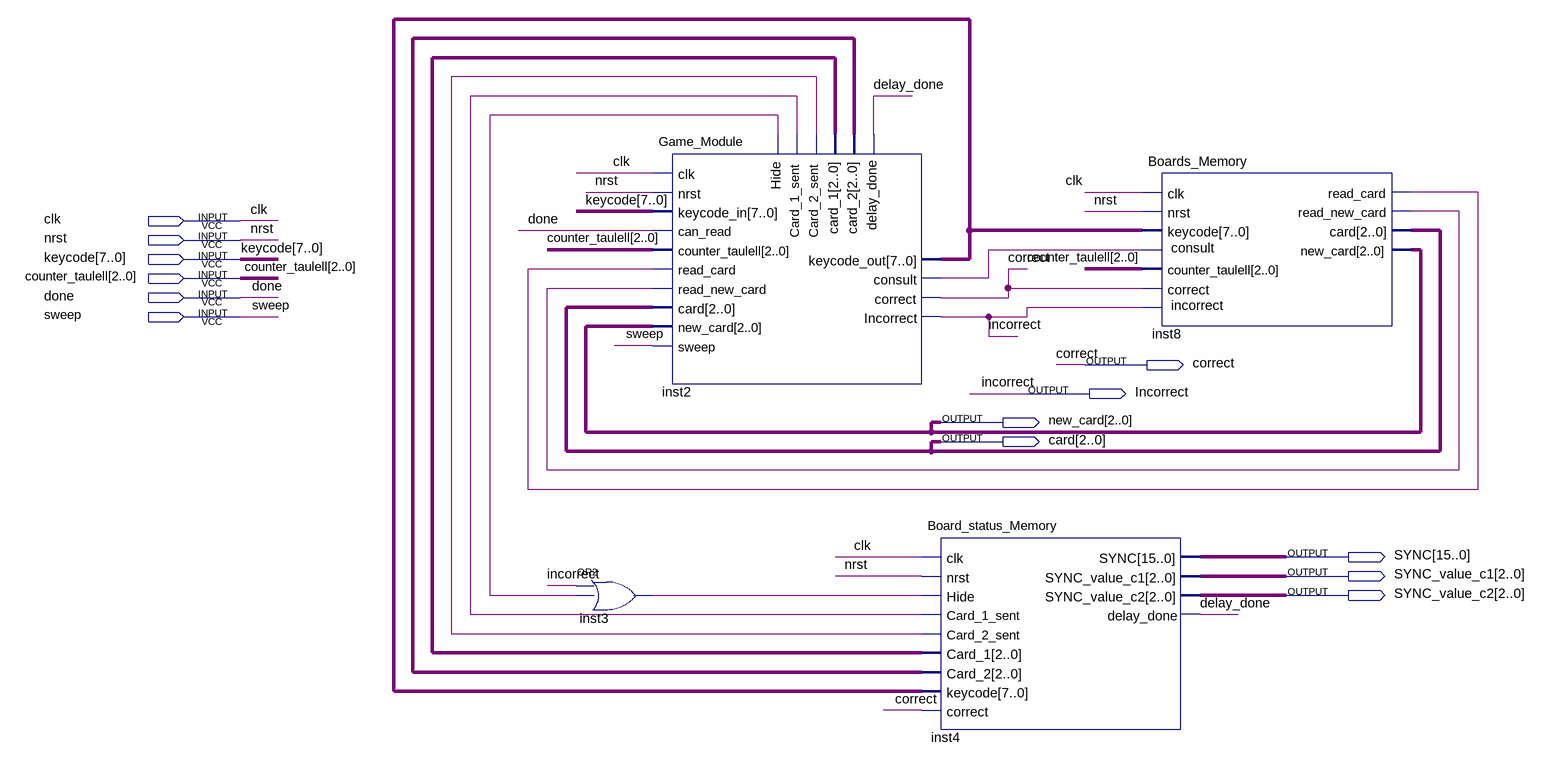
[diagram p0: schematic sheet]
// Quartus schematic sim_logica_game.bdf as structural Verilog: 4 symbols, 13 pins
module sim_logica_game (
  input  clk,
  input  nrst,
  input  [7:0] keycode,
  input  [2:0] counter_taulell,
  input  done,
  input  sweep,
  output correct,
  output Incorrect,
  output [2:0] new_card,
  output [2:0] card,
  output [15:0] SYNC,
  output [2:0] SYNC_value_c1,
  output [2:0] SYNC_value_c2
);

  wire delay_done, inst2_card_1_sent, inst2_card_2_sent, inst2_consult, inst2_hide, inst3_out,
       inst8_read_card, inst8_read_new_card;
  wire [2:0] inst2_card_1, inst2_card_2;
  wire [7:0] inst2_keycode_out;

  or inst3 (inst3_out, Incorrect, inst2_hide);
  Game_Module inst2 (
    .clk(clk), .nrst(nrst), .read_card(inst8_read_card), .read_new_card(inst8_read_new_card),
    .keycode_in(keycode), .can_read(done), .counter_taulell(counter_taulell), .card(card),
    .new_card(new_card), .sweep(sweep), .delay_done(delay_done), .keycode_out(inst2_keycode_out),
    .consult(inst2_consult), .Hide(inst2_hide), .card_1(inst2_card_1), .card_2(inst2_card_2),
    .Card_1_sent(inst2_card_1_sent), .Card_2_sent(inst2_card_2_sent), .Incorrect(Incorrect), .correct(correct));
  Board_status_Memory inst4 (
    .clk(clk), .nrst(nrst), .Hide(inst3_out), .correct(correct), .Card_1_sent(inst2_card_1_sent),
    .Card_2_sent(inst2_card_2_sent), .Card_1(inst2_card_1), .Card_2(inst2_card_2),
    .keycode(inst2_keycode_out), .SYNC(SYNC), .SYNC_value_c1(SYNC_value_c1), .SYNC_value_c2(SYNC_value_c2),
    .delay_done(delay_done));
  Boards_Memory inst8 (
    .clk(clk), .nrst(nrst), .consult(inst2_consult), .correct(correct), .incorrect(Incorrect),
    .keycode(inst2_keycode_out), .counter_taulell(counter_taulell), .read_card(inst8_read_card),
    .read_new_card(inst8_read_new_card), .card(card), .new_card(new_card));
endmodule
